# Altium schematic sheet Revenge.schdoc
size 432 x 307 mm
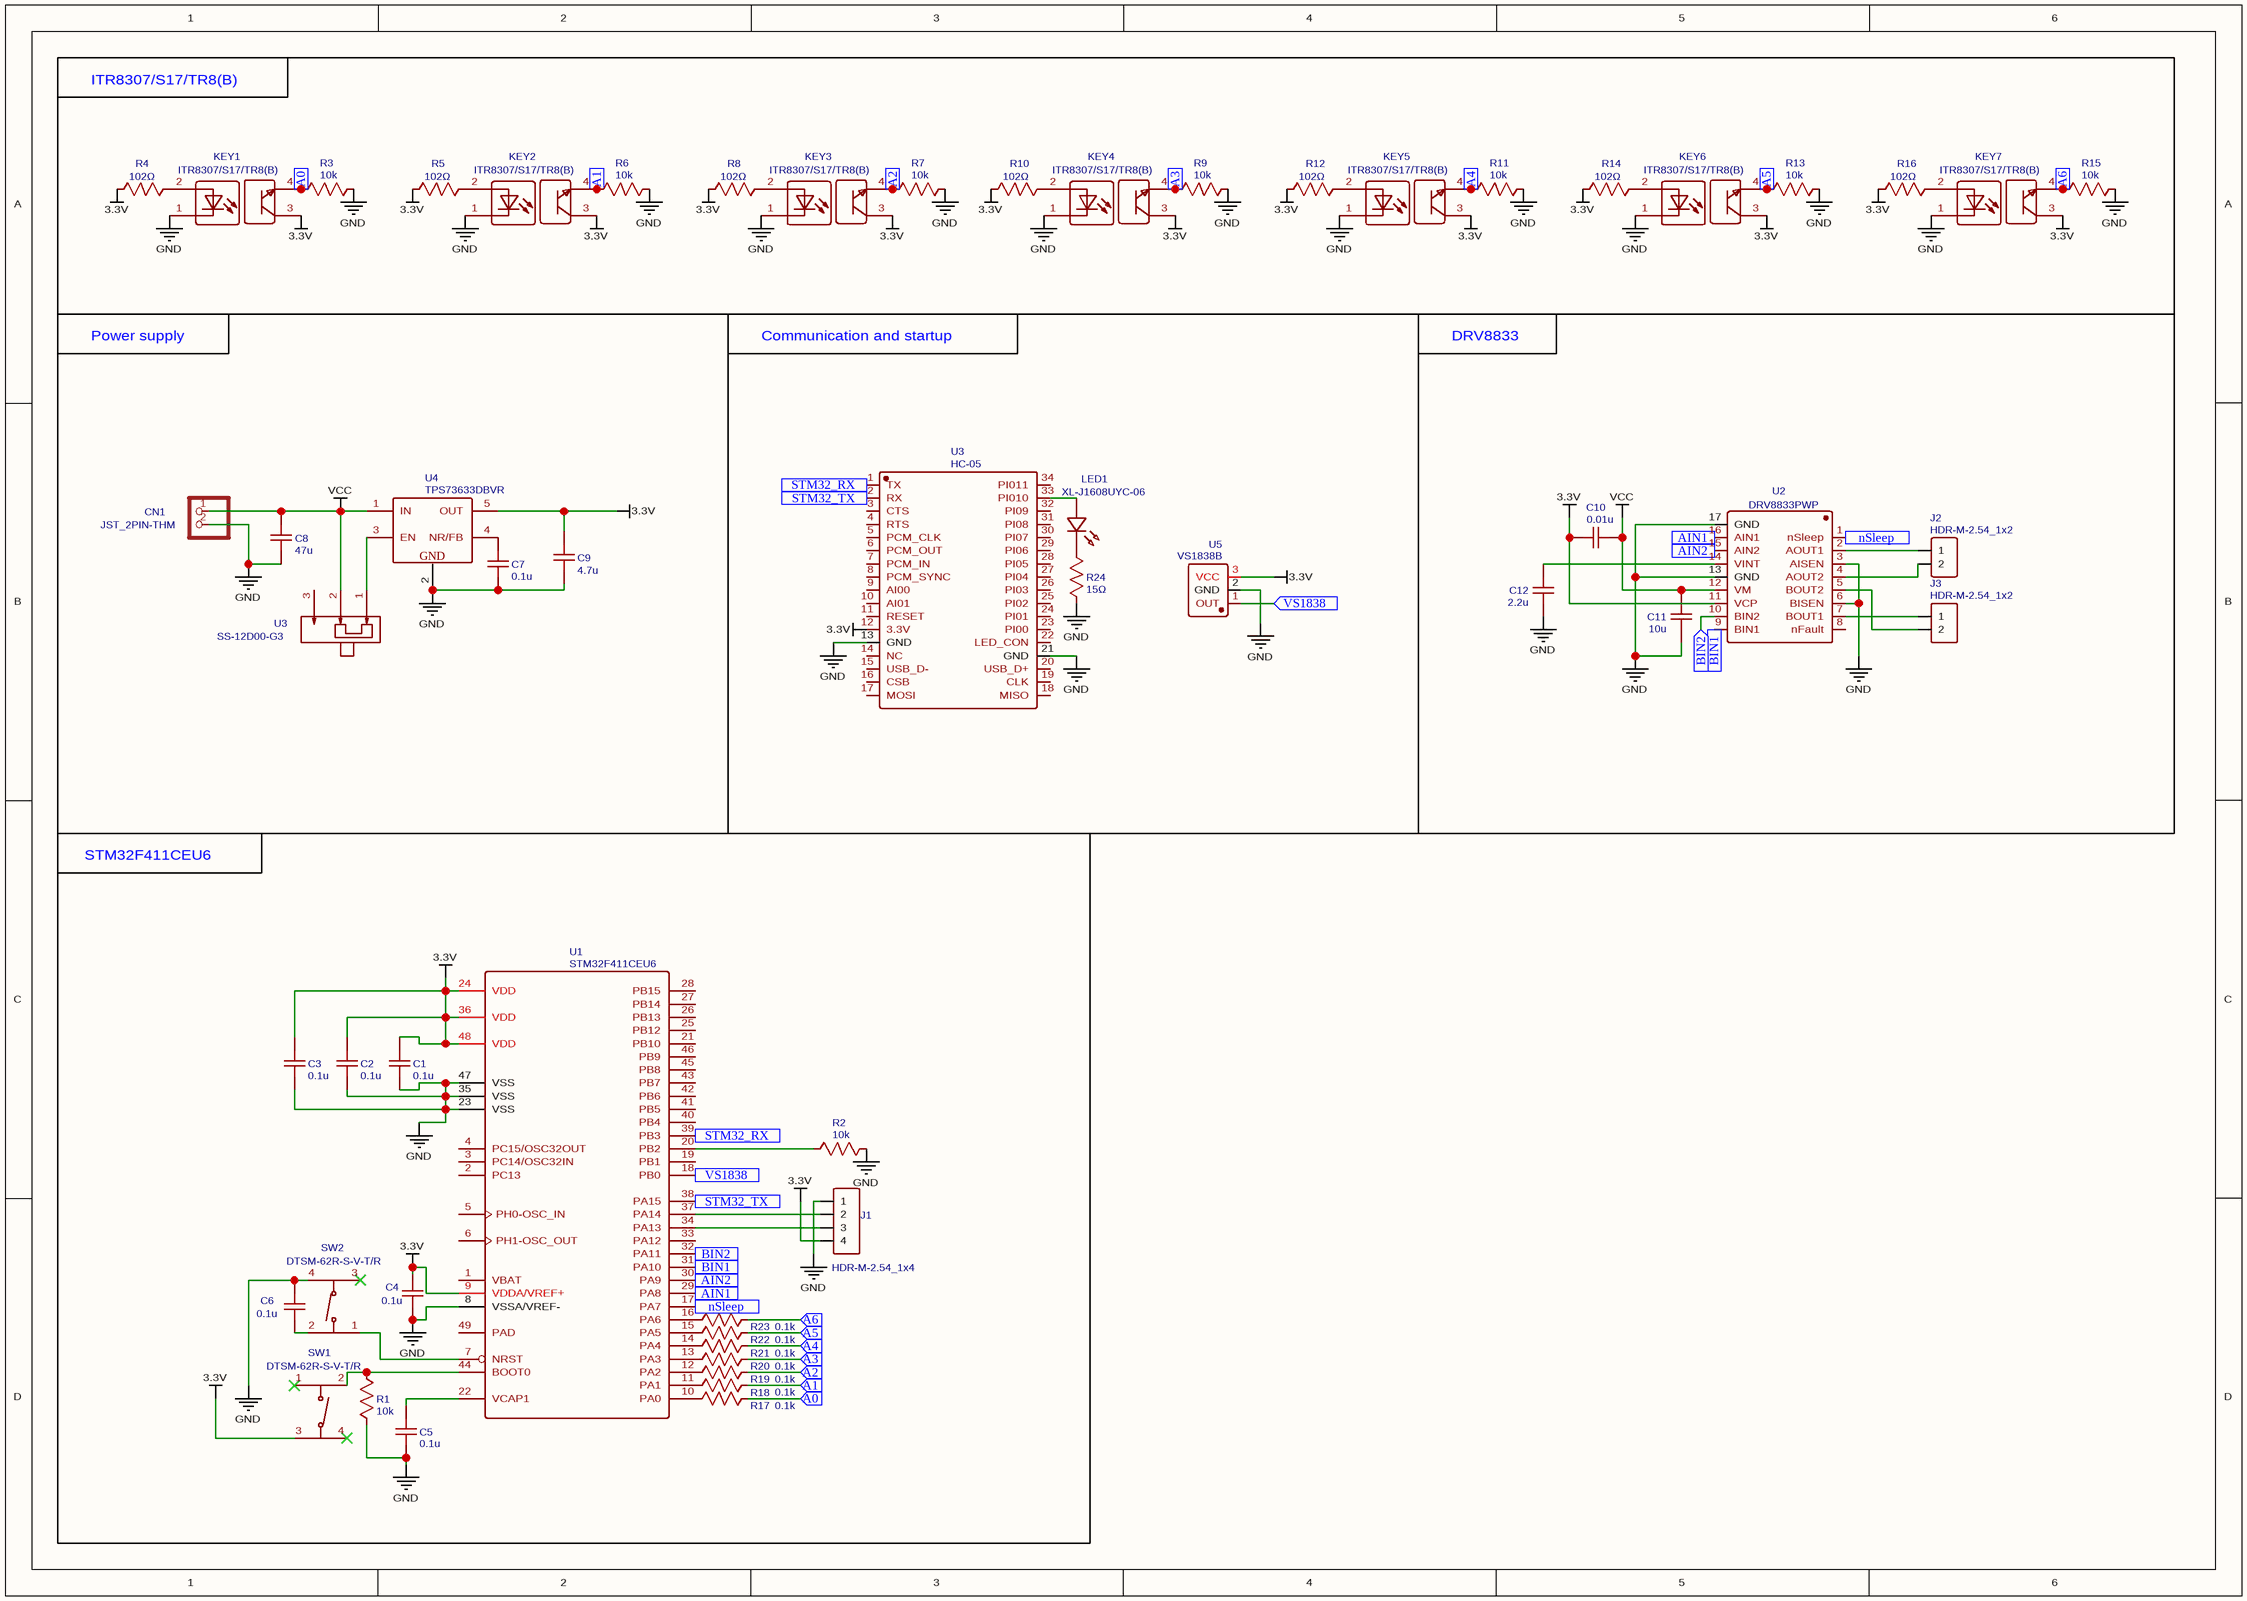
[diagram p0: Revenge.schdoc]

## Parts
(Parts that share a designator on the sheet are numbered #1, #2 ... from top to bottom, then left to right.)
C1  0.1u  [C0603]
C2  0.1u  [C0603]
C3  0.1u  [C0603]
C4  0.1u  [C0603]
C5  0.1u  [C0603]
C6  0.1u  [C0603]
C7  0.1u  [C0603]
C8  47u  [C1206]
C9  4.7u  [C1206]
C10  0.01u  [C0603]
C11  10u  [C0603]
C12  2.2u  [C0603]
CN1  JST_2PIN-THM  [JST-PH-2-THM]
J1  HDR-M-2.54_1x4  [HDR-M-2.54_1X4]
J2  HDR-M-2.54_1x2  [HDR-M-2.54_1X2]
J3  HDR-M-2.54_1x2  [HDR-M-2.54_1X2]
KEY1  ITR8307/S17/TR8(B)  [OPTO-SMD_ITR8307-S17-TR8-B-BL]
KEY2  ITR8307/S17/TR8(B)  [OPTO-SMD_ITR8307-S17-TR8-B-BL]
KEY3  ITR8307/S17/TR8(B)  [OPTO-SMD_ITR8307-S17-TR8-B-BL]
KEY4  ITR8307/S17/TR8(B)  [OPTO-SMD_ITR8307-S17-TR8-B-BL]
KEY5  ITR8307/S17/TR8(B)  [OPTO-SMD_ITR8307-S17-TR8-B-BL]
KEY6  ITR8307/S17/TR8(B)  [OPTO-SMD_ITR8307-S17-TR8-B-BL]
KEY7  ITR8307/S17/TR8(B)  [OPTO-SMD_ITR8307-S17-TR8-B-BL]
LED1  XL-J1608UYC-06  [LED-SMD_XL-J1608UYC-06]
R1  10k  [R0603]
R2  10k  [R0603]
R3  10k  [R0603]
R4  102Ω  [R0603]
R5  102Ω  [R0603]
R6  10k  [R0603]
R7  10k  [R0603]
R8  102Ω  [R0603]
R9  10k  [R0603]
R10  102Ω  [R0603]
R11  10k  [R0603]
R12  102Ω  [R0603]
R13  10k  [R0603]
R14  102Ω  [R0603]
R15  10k  [R0603]
R16  102Ω  [R0603]
R17  0.1k  [R0603]
R18  0.1k  [R0603]
R19  0.1k  [R0603]
R20  0.1k  [R0603]
R21  0.1k  [R0603]
R22  0.1k  [R0603]
R23  0.1k  [R0603]
R24  15Ω  [R0603]
SW1  DTSM-62R-S-V-T/R  [SW-SMD_4P-L6.2-W6.2-P4.50-LS9.0]
SW2  DTSM-62R-S-V-T/R  [SW-SMD_4P-L6.2-W6.2-P4.50-LS9.0]
U1  STM32F411CEU6  [UFQFPN-48_L7.0-W7.0-P0.50-BL-EP]
U2  DRV8833PWP  [TSSOP-16_L5.0-W4.4-P0.65-LS6.4-BL-EP]
U3#1  HC-05  [BULETM-SMD_HC-05]
U3#2  SS-12D00-G3  [SW-TH_3P-L8.8-W3.9-P2.50_SS12D00G3]
U4  TPS73633DBVR  [SOT-23-5_L3.0-W1.7-P0.95-LS2.8-BR]
U5  VS1838B  [OPTO-TH_VS1838B]

## Blocks framed on the sheet
ITR8307/S17/TR8(B): KEY1-KEY7 R3-R16
Power supply: C7-C9 CN1 U3#2 U4
Communication and startup: LED1 R24 U3#1 U5
DRV8833: C10-C12 J2 J3 U2
STM32F411CEU6: C1-C6 J1 R1 R2 R17-R23 SW1 SW2 U1

## Ports
A0 (in), A1 (in), A2 (in), A3 (in), A4 (in), A5 (in), A6 (in), AIN1 (in), AIN2 (in), BIN1 (in), BIN2 (in), nSleep (in), STM32_RX (in), STM32_TX (in), VS1838 (in)

## Nets
3.3V: C1.2 C2.2 C3.2 C4.2 C9.2 C10.2 J1.4 KEY1.3 KEY2.3 KEY3.3 KEY4.3 KEY5.3 KEY6.3 KEY7.3 R4.1 R5.1 R8.1 R10.1 R12.1 R14.1 R16.1 SW1.3 U1.9(VDDA/VREF+) U1.24(VDD) U1.36(VDD) U1.48(VDD) U2.11(VCP) U3#1.12(3.3V) U4.5(OUT) U5.3(VCC)
GND: C1.1 C2.1 C3.1 C4.1 C5.1 C6.2 C7.1 C8.1 C9.1 C11.1 C12.1 CN1.2 J1.1 KEY1.1 KEY2.1 KEY3.1 KEY4.1 KEY5.1 KEY6.1 KEY7.1 R1.1 R2.2 R3.1 R6.1 R7.1 R9.1 R11.1 R13.1 R15.1 R24.1 SW2.4 U1.8(VSSA/VREF-) U1.23(VSS) U1.35(VSS) U1.47(VSS) U2.3(AISEN) U2.6(BISEN) U2.13(GND) U2.17(GND) U3#1.13(GND) U3#1.21(GND) U4.2(GND) U5.2(GND)
VCC: C8.2 C10.1 C11.2 CN1.1 U2.12(VM) U3#2.2 U4.1(IN)
A0: KEY1.4 R3.2 R17.2 ; port A0
A1: KEY2.4 R6.2 R18.2 ; port A1
A2: KEY3.4 R7.2 R19.2 ; port A2
A3: KEY4.4 R9.2 R20.2 ; port A3
A4: KEY5.4 R11.2 R21.2 ; port A4
A5: KEY6.4 R13.2 R22.2 ; port A5
A6: KEY7.4 R15.2 R23.2 ; port A6
AIN1: U1.29(PA8) U2.16(AIN1) ; port AIN1
AIN2: U1.30(PA9) U2.15(AIN2) ; port AIN2
BIN1: U1.31(PA10) U2.9(BIN1) ; port BIN1
BIN2: U1.32(PA11) U2.10(BIN2) ; port BIN2
nSleep: U1.17(PA7) U2.1(nSleep) ; port nSleep
STM32_RX: U1.39(PB3) U3#1.1(TX) ; port STM32_RX
STM32_TX: U1.38(PA15) U3#1.2(RX) ; port STM32_TX
VS1838: U1.18(PB0) U5.1(OUT) ; port VS1838
NetC5_2: C5.2 U1.22(VCAP1)
NetC6_1: C6.1 SW2.2
NetC7_2: C7.2 U4.4(NR/FB)
NetC12_2: C12.2 U2.14(VINT)
NetJ1_2: J1.2 U1.37(PA14)
NetJ1_3: J1.3 U1.34(PA13)
NetJ2_1: J2.1 U2.2(AOUT1)
NetJ2_2: J2.2 U2.4(AOUT2)
NetJ3_1: J3.1 U2.7(BOUT1)
NetJ3_2: J3.2 U2.5(BOUT2)
NetKEY1_2: KEY1.2 R4.2
NetKEY2_2: KEY2.2 R5.2
NetKEY3_2: KEY3.2 R8.2
NetKEY4_2: KEY4.2 R10.2
NetKEY5_2: KEY5.2 R12.2
NetKEY6_2: KEY6.2 R14.2
NetKEY7_2: KEY7.2 R16.2
NetLED1_1: LED1.1(C) R24.2
NetLED1_2: LED1.2(A) U3#1.33(PI010)
NetR1_2: R1.2 SW1.2 U1.44(BOOT0)
NetR2_1: R2.1 U1.20(PB2)
NetR17_1: R17.1 U1.10(PA0)
NetR18_1: R18.1 U1.11(PA1)
NetR19_1: R19.1 U1.12(PA2)
NetR20_1: R20.1 U1.13(PA3)
NetR21_1: R21.1 U1.14(PA4)
NetR22_1: R22.1 U1.15(PA5)
NetR23_1: R23.1 U1.16(PA6)
NetSW2_1: SW2.1 U1.7(NRST)
NetU3#2_1: U3#2.1 U4.3(EN)

Not connected (* = marked no-connect by the designer): SW1 1* 4*; SW2 3*; U1 1(VBAT) 2(PC13) 3(PC14/OSC32IN) 4(PC15/OSC32OUT) 5(PH0-OSC_IN) 6(PH1-OSC_OUT) 19(PB1) 21(PB10) 25(PB12) 26(PB13) 27(PB14) 28(PB15) 33(PA12) 40(PB4) 41(PB5) 42(PB6) 43(PB7) 45(PB8) 46(PB9) 49(PAD); U2 8(nFault); U3#1 3(CTS) 4(RTS) 5(PCM_CLK) 6(PCM_OUT) 7(PCM_IN) 8(PCM_SYNC) 9(AI00) 10(AI01) 11(RESET) 14(NC) 15(USB_D-) 16(CSB) 17(MOSI) 18(MISO) 19(CLK) 20(USB_D+) 22(LED_CON) 23(PI00) 24(PI01) 25(PI02) 26(PI03) 27(PI04) 28(PI05) 29(PI06) 30(PI07) 31(PI08) 32(PI09) 34(PI011); U3#2 3

## Library data of the parts
C1-C7 = 0.1u: nameAlias: Value(F); Contributor: LCEDA_Lib; spicePre: C; spiceSymbolName: C_0603_US
C8 = 47u: nameAlias: Value(F); Contributor: LCEDA_Lib; spicePre: C; spiceSymbolName: C_1206_US
C9 = 4.7u: nameAlias: Value(F); Contributor: LCEDA_Lib; spicePre: C; spiceSymbolName: C_1206_US
C10 = 0.01u: nameAlias: Value(F); Contributor: LCEDA_Lib; spicePre: C; spiceSymbolName: C_0603_US
C11 = 10u: nameAlias: Value(F); Contributor: LCEDA_Lib; spicePre: C; spiceSymbolName: C_0603_US
C12 = 2.2u: nameAlias: Value(F); Contributor: LCEDA_Lib; spicePre: C; spiceSymbolName: C_0603_US
CN1 = JST_2PIN-THM: description: JST 2-Pin Connectors of various flavors; Contributor: Adafruit; spicePre: C; spiceSymbolName: JST_2PIN-THM
J1 = HDR-M-2.54_1x4: Contributor: LCEDA_Lib; Supplier Part: C124378; Supplier: LCSC; spicePre: J; spiceSymbolName: HDR-M-2.54_1x4
J2 J3 = HDR-M-2.54_1x2: Contributor: LCEDA_Lib; Supplier Part: C124375; Supplier: LCSC; spicePre: J; spiceSymbolName: HDR-M-2.54_1x2
KEY1-KEY7 = ITR8307/S17/TR8(B): Manufacturer: EVERLIGHT(亿光); Supplier: LCSC; Manufacturer Part: ITR8307/S17/TR8(B); Supplier Part: C81632; JLCPCB Part Class: Extended Part; spicePre: K; spiceSymbolName: ITR8307/S17/TR8(B)
LED1 = XL-J1608UYC-06: Manufacturer: XINGLIGHT(成兴光); Contributor: lcsc; Supplier: LCSC; Supplier Part: C48586670; Manufacturer Part: XL-J1608UYC-06; JLCPCB Part Class: Extended Part; spicePre: L; spiceSymbolName: XL-J1608UYC-06
R1-R3 R6 R7 R9 R11 R13 R15 = 10k: nameAlias: Value(Ω); Contributor: LCEDA_Lib; spicePre: R; spiceSymbolName: R_0603_US
R4 R5 R8 R10 R12 R14 R16 = 102Ω: nameAlias: Value(Ω); Contributor: LCEDA_Lib; spicePre: R; spiceSymbolName: R_0603_US
R17-R23 = 0.1k: nameAlias: Value(Ω); Contributor: LCEDA_Lib; spicePre: R; spiceSymbolName: R_0603_US
R24 = 15Ω: nameAlias: Value(Ω); Contributor: LCEDA_Lib; spicePre: R; spiceSymbolName: R_0603_US
SW1 SW2 = DTSM-62R-S-V-T/R: Manufacturer: Diptronics(圜达); Contributor: LCSC; Supplier: LCSC; Supplier Part: C483792; Manufacturer Part: DTSM-62R-S-V-T/R; JLCPCB Part Class: Extended Part; spicePre: S; spiceSymbolName: DTSM-62R-S-V-T/R
U1 = STM32F411CEU6: Manufacturer: ST(意法半导体); Supplier: LCSC; Manufacturer Part: STM32F411CEU6; Supplier Part: C60420; JLCPCB Part Class: Extended Part; spicePre: U; spiceSymbolName: STM32F411CEU6
U2 = DRV8833PWP: Manufacturer: TI(德州仪器); Manufacturer Part: DRV8833PWPR; Supplier: LCSC; Supplier Part: C50506; JLCPCB Part Class: Extended Part; spicePre: U; spiceSymbolName: DRV8833PWP
U3#1 = HC-05: Manufacturer: null; Contributor: LCSC; Supplier: LCSC; Supplier Part: C9900001063; Manufacturer Part: HC-05; JLCPCB Part Class: Extended Part; spicePre: U; spiceSymbolName: HC-05
U3#2 = SS-12D00-G3: Manufacturer: SOFNG(硕方); Contributor: lcsc; Supplier: LCSC; Supplier Part: C22355741; Manufacturer Part: SS-12D00-G3; JLCPCB Part Class: Extended Part; spicePre: U; spiceSymbolName: SS-12D00-G3
U4 = TPS73633DBVR: Manufacturer: TI(德州仪器); Supplier: LCSC; Manufacturer Part: TPS73633DBVR; Supplier Part: C28038; JLCPCB Part Class: Extended Part; spicePre: U; spiceSymbolName: TPS73633DBVR
U5 = VS1838B: Manufacturer: null; Contributor: LCSC; Supplier: LCSC; Supplier Part: C9900002107; Manufacturer Part: VS1838B; JLCPCB Part Class: Extended Part; spicePre: U; spiceSymbolName: VS1838B